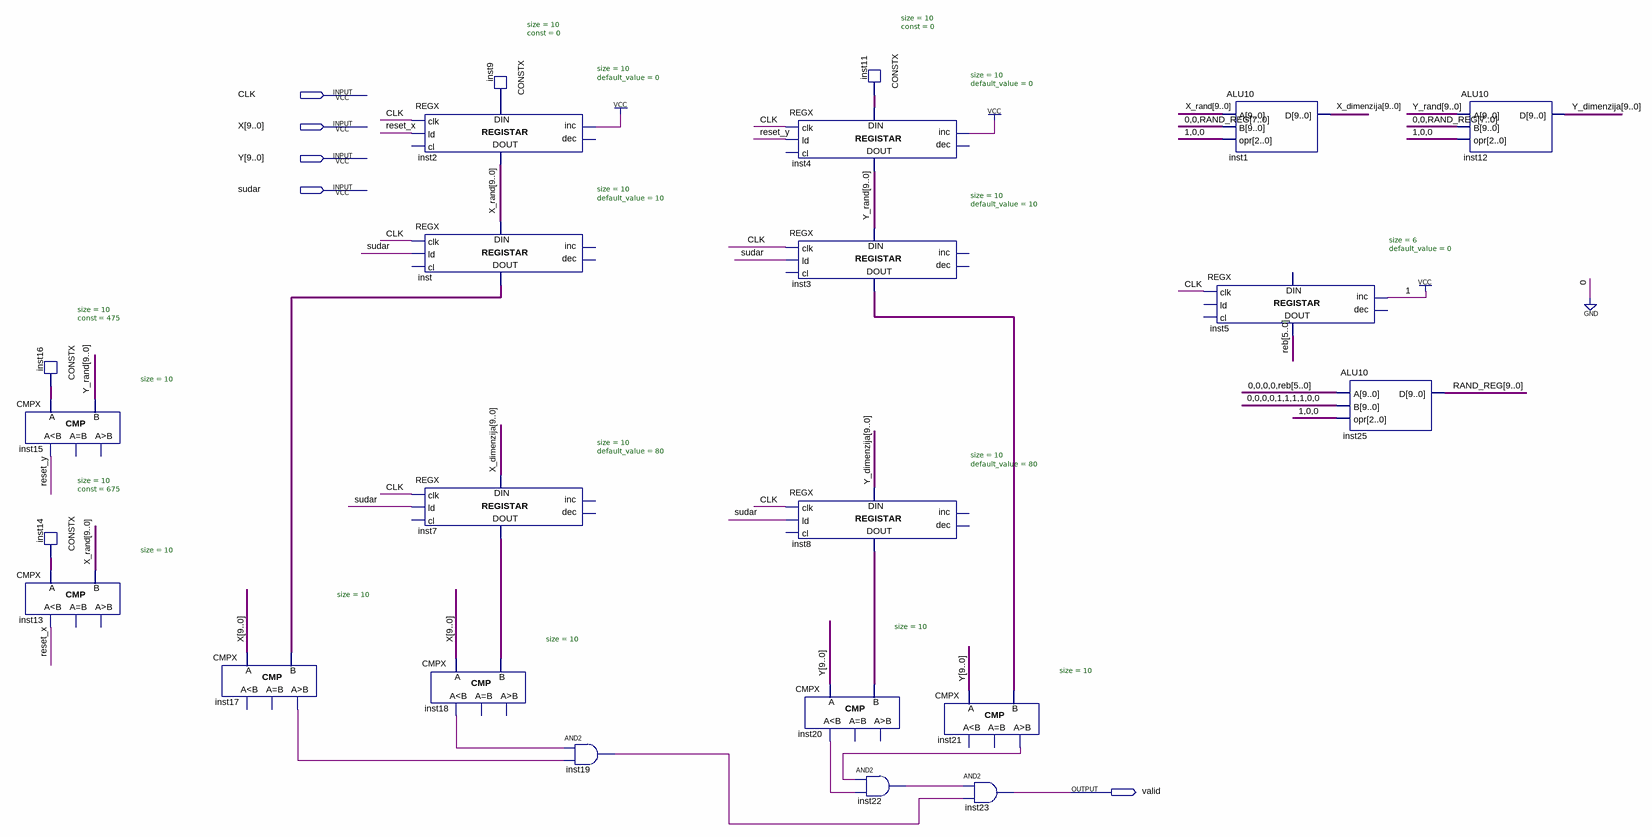
[diagram p0: schematic sheet]
// Quartus schematic Kvadrat.bdf as structural Verilog: 23 symbols, 5 pins
module Kvadrat (
  input  CLK,
  input  [9:0] X,
  input  [9:0] Y,
  input  sudar,
  output valid
);

  wire inst17_gr, inst18_ls, inst19_out, inst20_ls, inst21_gr, inst22_out, reset_x, reset_y;
  wire [5:0] reb;
  wire [9:0] inst3_data_out, inst7_data_out, inst8_data_out, inst9_data, inst11_data, inst14_data,
       inst16_data, inst_data_out, RAND_REG, X_dimenzija, X_rand, Y_dimenzija, Y_rand;

  CONSTX #(.size(10), .\const (475)) inst16 (.data(inst16_data));
  CMPX #(.size(10)) inst15 (.A(inst16_data), .B(Y_rand), .ls(reset_y));  // open: eq, gr
  CONSTX #(.size(10), .\const (675)) inst14 (.data(inst14_data));
  CMPX #(.size(10)) inst13 (.A(inst14_data), .B(X_rand), .ls(reset_x));  // open: eq, gr
  CMPX #(.size(10)) inst17 (.A(X), .B(inst_data_out), .gr(inst17_gr));  // open: ls, eq
  REGX #(.size(10), .default_value(0)) inst2 (
    .clk(CLK), .ld(reset_x), .inc(1'b1), .data_in(inst9_data), .data_out(X_rand));  // open: cl, dec
  REGX #(.size(10), .default_value(10)) inst (
    .clk(CLK), .ld(sudar), .data_in(X_rand), .data_out(inst_data_out));  // open: cl, inc, dec
  REGX #(.size(10), .default_value(80)) inst7 (
    .clk(CLK), .ld(sudar), .data_in(X_dimenzija), .data_out(inst7_data_out));  // open: cl, inc, dec
  CMPX #(.size(10)) inst18 (.A(X), .B(inst7_data_out), .ls(inst18_ls));  // open: eq, gr
  CONSTX #(.size(10), .\const (0)) inst9 (.data(inst9_data));
  and inst19 (inst19_out, inst18_ls, inst17_gr);
  REGX #(.size(10), .default_value(0)) inst4 (
    .clk(CLK), .ld(reset_y), .inc(1'b1), .data_in(inst11_data), .data_out(Y_rand));  // open: cl, dec
  REGX #(.size(10), .default_value(10)) inst3 (
    .clk(CLK), .ld(sudar), .data_in(Y_rand), .data_out(inst3_data_out));  // open: cl, inc, dec
  REGX #(.size(10), .default_value(80)) inst8 (
    .clk(CLK), .ld(sudar), .data_in(Y_dimenzija), .data_out(inst8_data_out));  // open: cl, inc, dec
  CMPX #(.size(10)) inst20 (.A(Y), .B(inst8_data_out), .ls(inst20_ls));  // open: eq, gr
  CONSTX #(.size(10), .\const (0)) inst11 (.data(inst11_data));
  and inst22 (inst22_out, inst21_gr, inst20_ls);
  CMPX #(.size(10)) inst21 (.A(Y), .B(inst3_data_out), .gr(inst21_gr));  // open: ls, eq
  and inst23 (valid, inst22_out, inst19_out);
  REGX #(.size(6), .default_value(0)) inst5 (.clk(CLK), .inc(1'b1), .data_out(reb));  // open: ld, cl, dec, data_in
  ALU10 inst1 (.A(X_rand), .B({2'b00, RAND_REG[7:0]}), .opr(3'b100), .D(X_dimenzija));
  ALU10 inst25 (.A({4'b0000, reb}), .B(10'b0000111100), .opr(3'b100), .D(RAND_REG));
  ALU10 inst12 (.A(Y_rand), .B({2'b00, RAND_REG[7:0]}), .opr(3'b100), .D(Y_dimenzija));
endmodule
